# EAGLE design PAYLOAD (EAGLE 9.6.2)
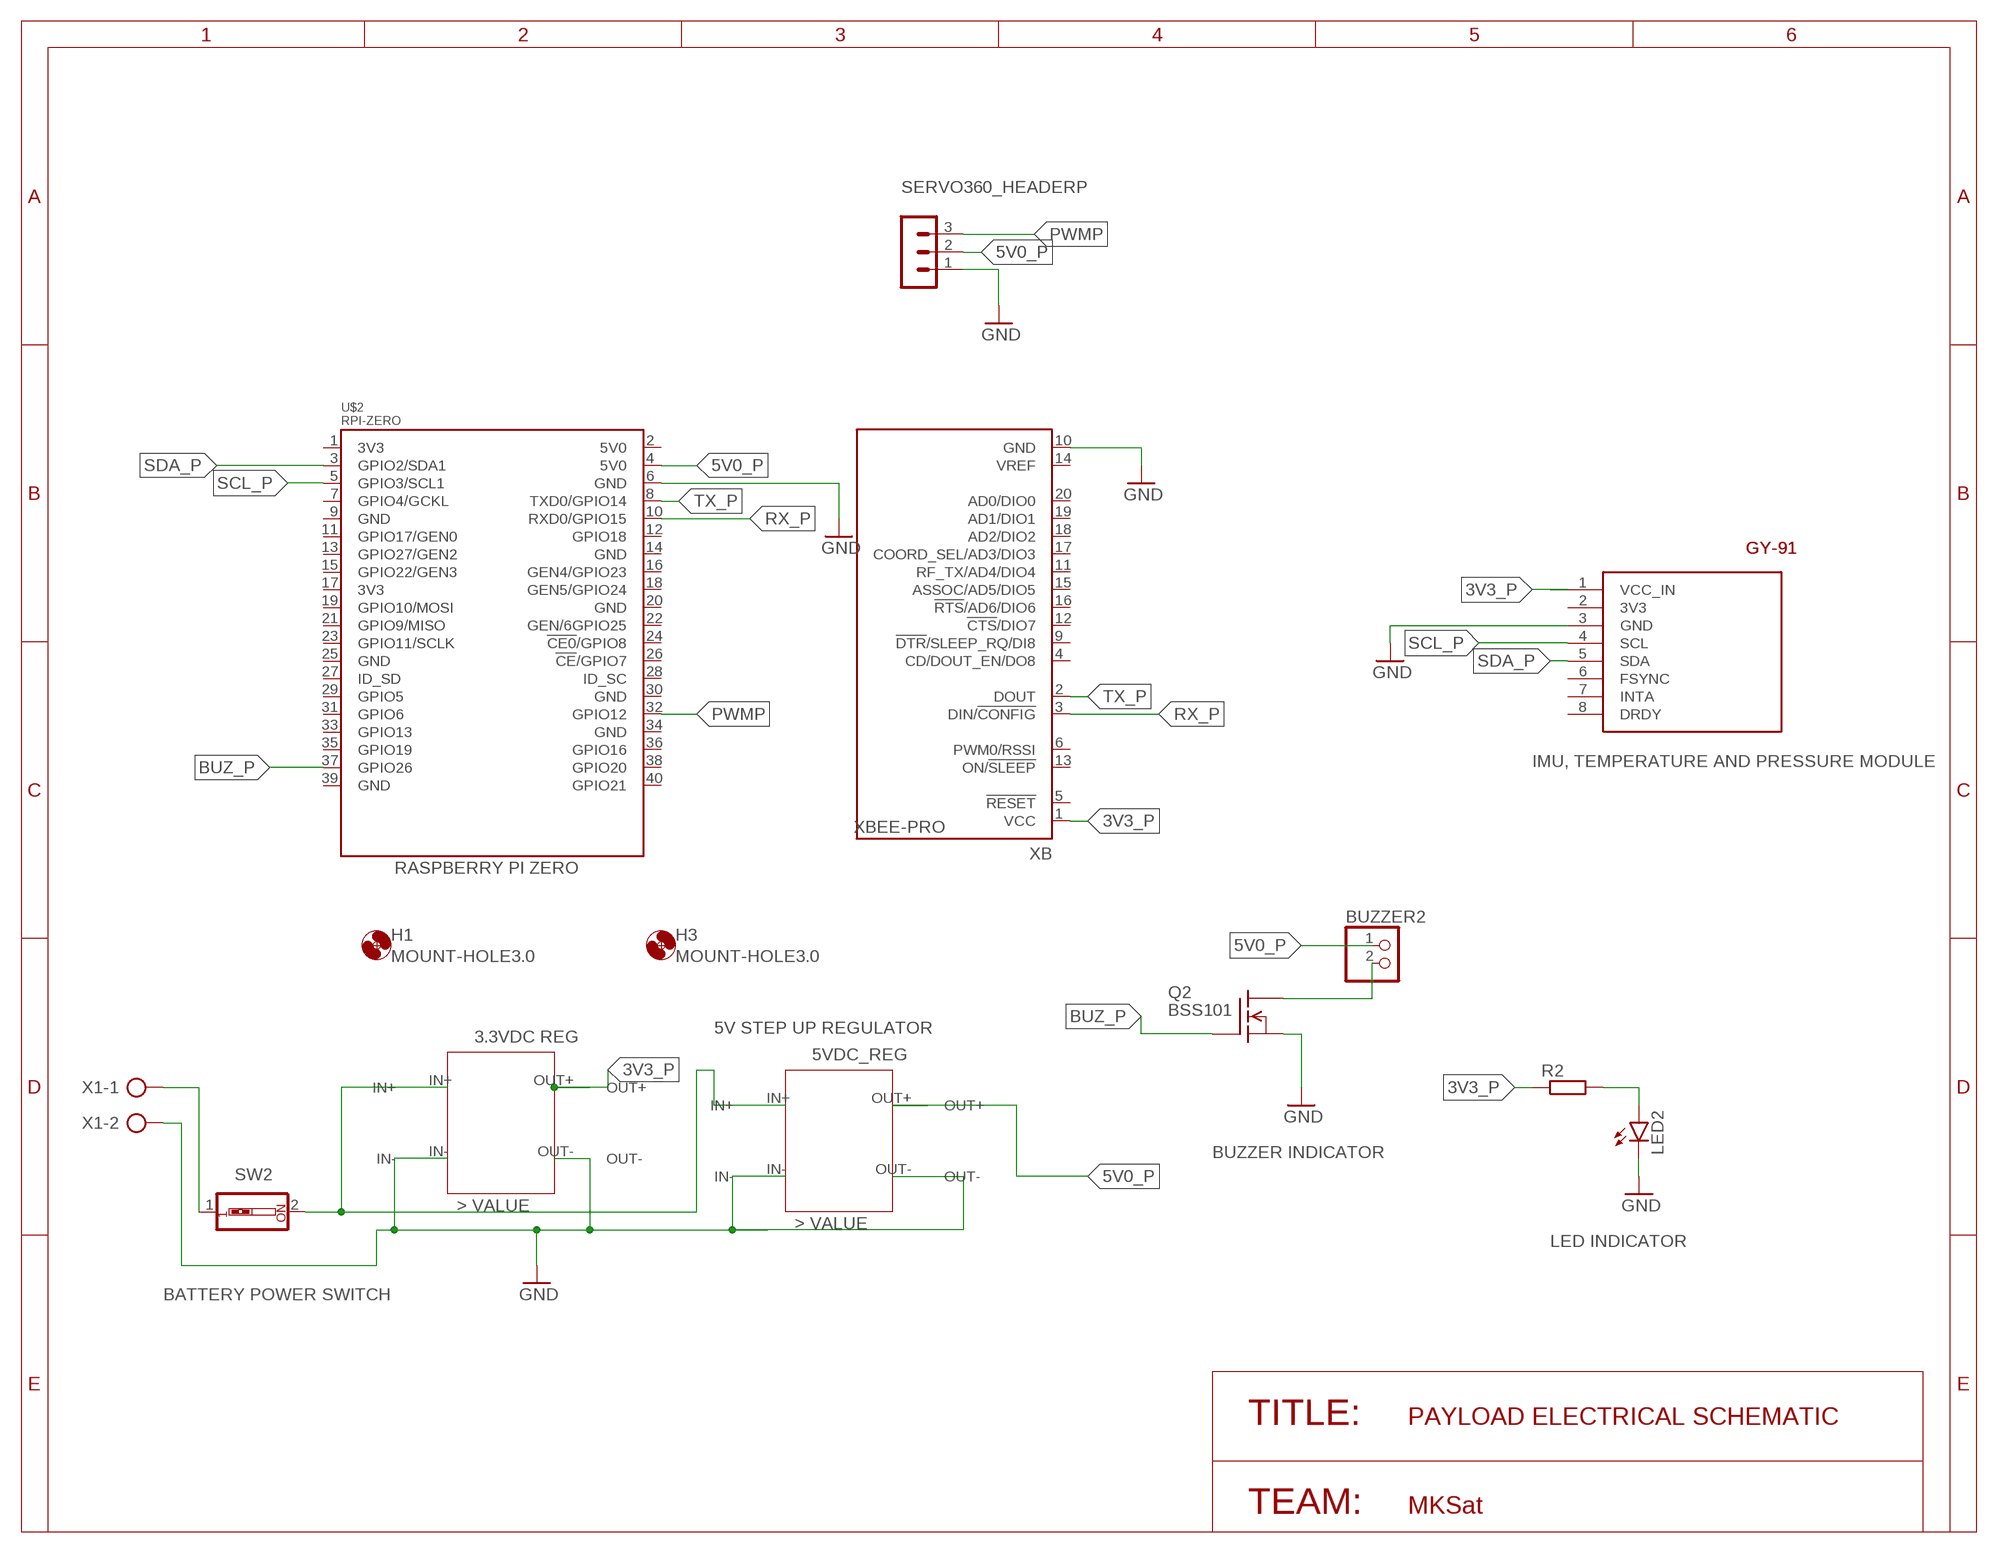
[diagram p0: schematic, sheet 1]

## Parts
BUZZER2  PINHD-1X2/90  [1X02/90]
GY-91  GY-86  [GY-86]
H1  MOUNT-HOLE3.0  [3,0]
H3  MOUNT-HOLE3.0  [3,0]
LED2  LED5MM  [LED5MM]
Q2  BSS101  [TO92]
R2  R-EU_0207/12  [0207/12]
SERVO360_HEADERP  MA03-1  [MA03-1]
SW2  SW_DIP-1  [EDG-01]
U$1  3VDC_REG  [3VDC_REG]
U$2  RPI-ZERO  [RASPBERRYPI_BASTELSTUBE_V13_RASPI_BOARD_B+_FULL]
U$3  5VDC_REG  [5VDC_REG]
X1  AK500/2  [AK500/2]
XB  XBEE-PRO  [XBEE-PRO]

## Nets
3V3_P: GY-91.1(VCC_IN) R2.1 U$1.OUT+ XB.1(VCC)
5V0_P: BUZZER2.1 SERVO360_HEADERP.2 U$2.4(5V0) U$3.OUT+
BUZ_P: Q2.2(G) U$2.37(GPIO26)
GND: GY-91.3(GND) LED2.K(C) Q2.1(S) SERVO360_HEADERP.1 U$1.IN- U$1.OUT- U$2.6(GND) U$3.IN- U$3.OUT- X1.2 XB.10(GND)
N$1: BUZZER2.2 Q2.3(D)
N$2: SW2.2 U$1.IN+ U$3.IN+
N$3: SW2.1 X1.1
N$11: LED2.A R2.2
PWMP: SERVO360_HEADERP.3 U$2.32(GPIO12)
RX_P: U$2.10(RXD0/GPIO15) XB.3(DIN/!CONFIG)
SCL_P: GY-91.4(SCL) U$2.5(GPIO3/SCL1)
SDA_P: GY-91.5(SDA) U$2.3(GPIO2/SDA1)
TX_P: U$2.8(TXD0/GPIO14) XB.2(DOUT)
Unconnected: GY-91.2(3V3) GY-91.6(FSYNC) GY-91.7(INTA) GY-91.8(DRDY) U$2.1(3V3) U$2.2(5V0) U$2.7(GPIO4/GCKL) U$2.9(GND) U$2.11(GPIO17/GEN0) U$2.12(GPIO18) U$2.13(GPIO27/GEN2) U$2.14(GND) U$2.15(GPIO22/GEN3) U$2.16(GEN4/GPIO23) U$2.17(3V3) U$2.18(GEN5/GPIO24) U$2.19(GPIO10/MOSI) U$2.20(GND) U$2.21(GPIO9/MISO) U$2.22(GEN/6GPIO25) U$2.23(GPIO11/SCLK) U$2.24(!CE0!/GPIO8) U$2.25(GND) U$2.26(!CE!/GPIO7) U$2.27(ID_SD) U$2.28(ID_SC) U$2.29(GPIO5) U$2.30(GND) U$2.31(GPIO6) U$2.33(GPIO13) U$2.34(GND) U$2.35(GPIO19) U$2.36(GPIO16) U$2.38(GPIO20) U$2.39(GND) U$2.40(GPIO21) XB.4(CD/DOUT_EN/DO8) XB.5(!RESET) XB.6(PWM0/RSSI) XB.9(!DTR!/SLEEP_RQ/DI8) XB.11(RF_TX/AD4/DIO4) XB.12(!CTS!/DIO7) XB.13(ON/!SLEEP) XB.14(VREF) XB.15(ASSOC/AD5/DIO5) XB.16(!RTS!/AD6/DIO6) XB.17(COORD_SEL/AD3/DIO3) XB.18(AD2/DIO2) XB.19(AD1/DIO1) XB.20(AD0/DIO0)

## Notes on the sheet
- GY-91 | GY-91
- IMU, TEMPERATURE AND PRESSURE MODULE
- RASPBERRY PI ZERO
- 5V STEP UP REGULATOR
- BUZZER INDICATOR
- LED INDICATOR
- BATTERY POWER SWITCH
- TITLE: | PAYLOAD ELECTRICAL SCHEMATIC
- TEAM: | MKSat

## Library data of the parts
BUZZER2 = pinhead:PINHD-1X2: PIN HEADER
GY-91 = GY_Boards:GY-86
H1 H3 = holes:MOUNT-HOLE: MOUNTING HOLE with drill center marker
LED2 = led:LED: LED OSRAM: - CHIPLED LG R971, LG N971, LY N971, LG Q971, LY Q971, LO R971, LY R971 LH N974, LH R974 LS Q976, LO Q976, LY Q976 LO Q996 - Hyper CHIPLED LW Q18S LB Q993, LB Q99A, LB R99A - SideLED LS A670, LO A670, LY A670, LG A670, LP A670 LB A673, LV A673, LT A673, LW A673 LH A674 LY A675 LS A676, LA A676, LO A676, LY A676, LW A676 LS A679, LY A679, LG A679 - Hyper Micro SIDELED® LS Y876, LA Y876, LO Y876, LY Y876 LT Y87S - SmartLED LW L88C, LW L88S LB L89C, LB L89S, LG L890 LS L89K, LO L89K, LY L89K LS L896, LA L896, LO L896, LY L896 - TOPLED LS T670, LO T670, LY T670, LG T670, LP T670 LSG T670, LSP T670, LSY T670, LOP T670, LYG T670 LG T671, LOG T671, LSG T671 LB T673, LV T673, LT T673, LW T673 LH T674 LS T676, LA T676, LO T676, LY T676, LB T676, LH T676, LSB T676, LW T676 LB T67C, LV T67C, LT T67C, LS T67K, LO T67K, LY T67K, LW E67C LS E67B, LA E67B, LO E67B, LY E67B, LB E67C, LV E67C, LT E67C LW T67C LS T679, LY T679, LG T679 LS T770, LO T770, LY T770, LG T770, LP T770 LB T773, LV T773, LT T773, LW T773 LH T774 LS E675, LA E675, LY E675, LS T675 LS T776, LA T776, LO T776, LY T776, LB T776 LHGB T686 LT T68C, LB T68C - Hyper Mini TOPLED® LB M676 - Mini TOPLED Santana® LG M470 LS M47K, LO M47K, LY M47K Source: http://www.osram.convergy.de LUXEON: - LUMILED® LXK2-PW12-R00, LXK2-PW12-S00, LXK2-PW14-U00, LXK2-PW14-V00 LXK2-PM12-R00, LXK2-PM12-S00, LXK2-PM14-U00 LXK2-PE12-Q00, LXK2-PE12-R00, LXK2-PE12-S00, LXK2-PE14-T00, LXK2-PE14-U00 LXK2-PB12-K00, LXK2-PB12-L00, LXK2-PB12-M00, LXK2-PB14-N00, LXK2-PB14-P00, LXK2-PB14-Q00 LXK2-PR12-L00, LXK2-PR12-M00, LXK2-PR14-Q00, LXK2-PR14-R00 LXK2-PD12-Q00, LXK2-PD12-R00, LXK2-PD12-S00 LXK2-PH12-R00, LXK2-PH12-S00 LXK2-PL12-P00, LXK2-PL12-Q00, LXK2-PL12-R00 Source: www.luxeon.com KINGBRIGHT: KA-3528ASYC Source: www.kingbright.com
Q2 = transistor-fet:BSS101: N-Channel Enhancement MOSFET 200V; 0,16A; 11Ohm
R2 = rcl:R-EU_: RESISTOR, European symbol; SPICEPREFIX: R
SERVO360_HEADERP = con-lstb:MA03-1: PIN HEADER; OC_FARNELL: unknown; OC_NEWARK: unknown
SW2 = special:SW_DIP-1: DIP SWITCH
U$1 = VOLTAGE_REGULATORS_CANSAT:3VDC_REG
U$2 = RPI-Zero:RPI-ZERO
U$3 = VOLTAGE_REGULATORS_CANSAT:5VDC_REG
X1 = con-ptr500:AK500/2: CONNECTOR; OC_FARNELL: unknown; OC_NEWARK: unknown
XB = maxstream:XBEE: XBee (TM) /XBee-PRO(TM) OEM RF Modules Source: MaxStream, Inc. xbee_productmanual.pdf; MPN: XBP24-AWI-001; OC_FARNELL: 1337916; OC_NEWARK: 42M2667

## Board
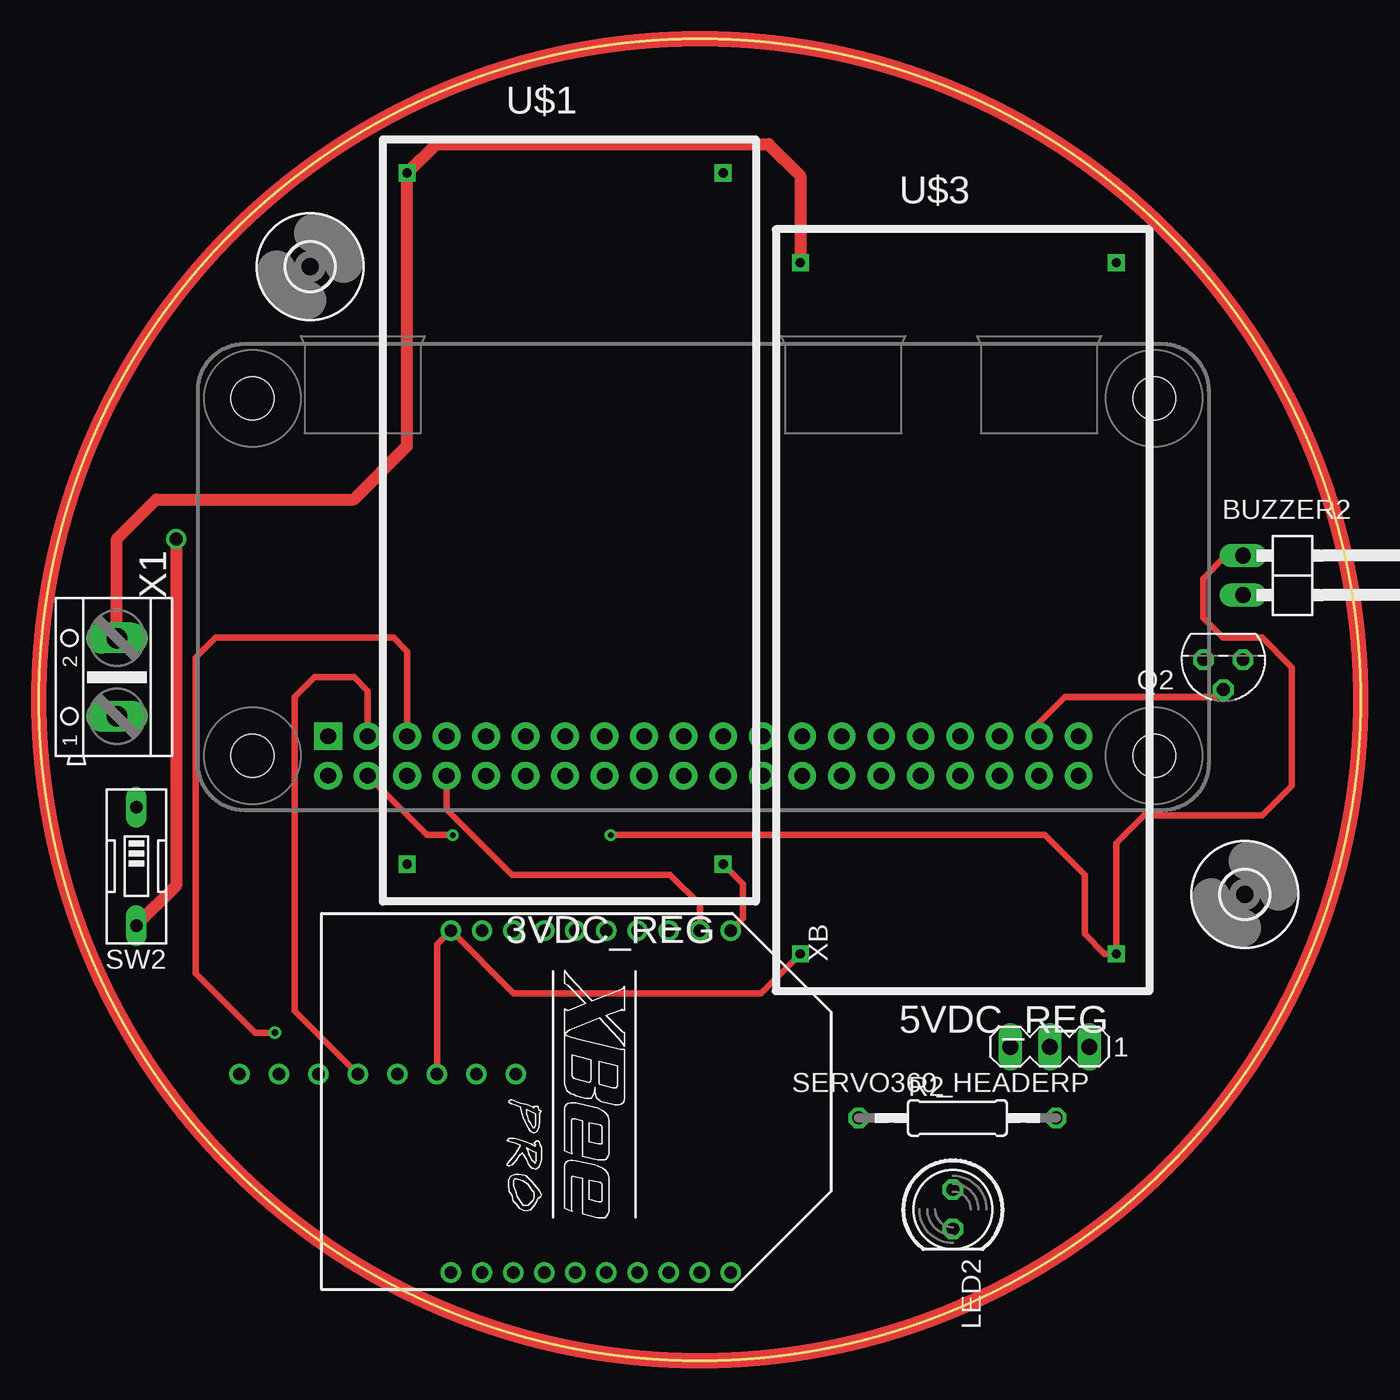
[diagram p1: board, top side]
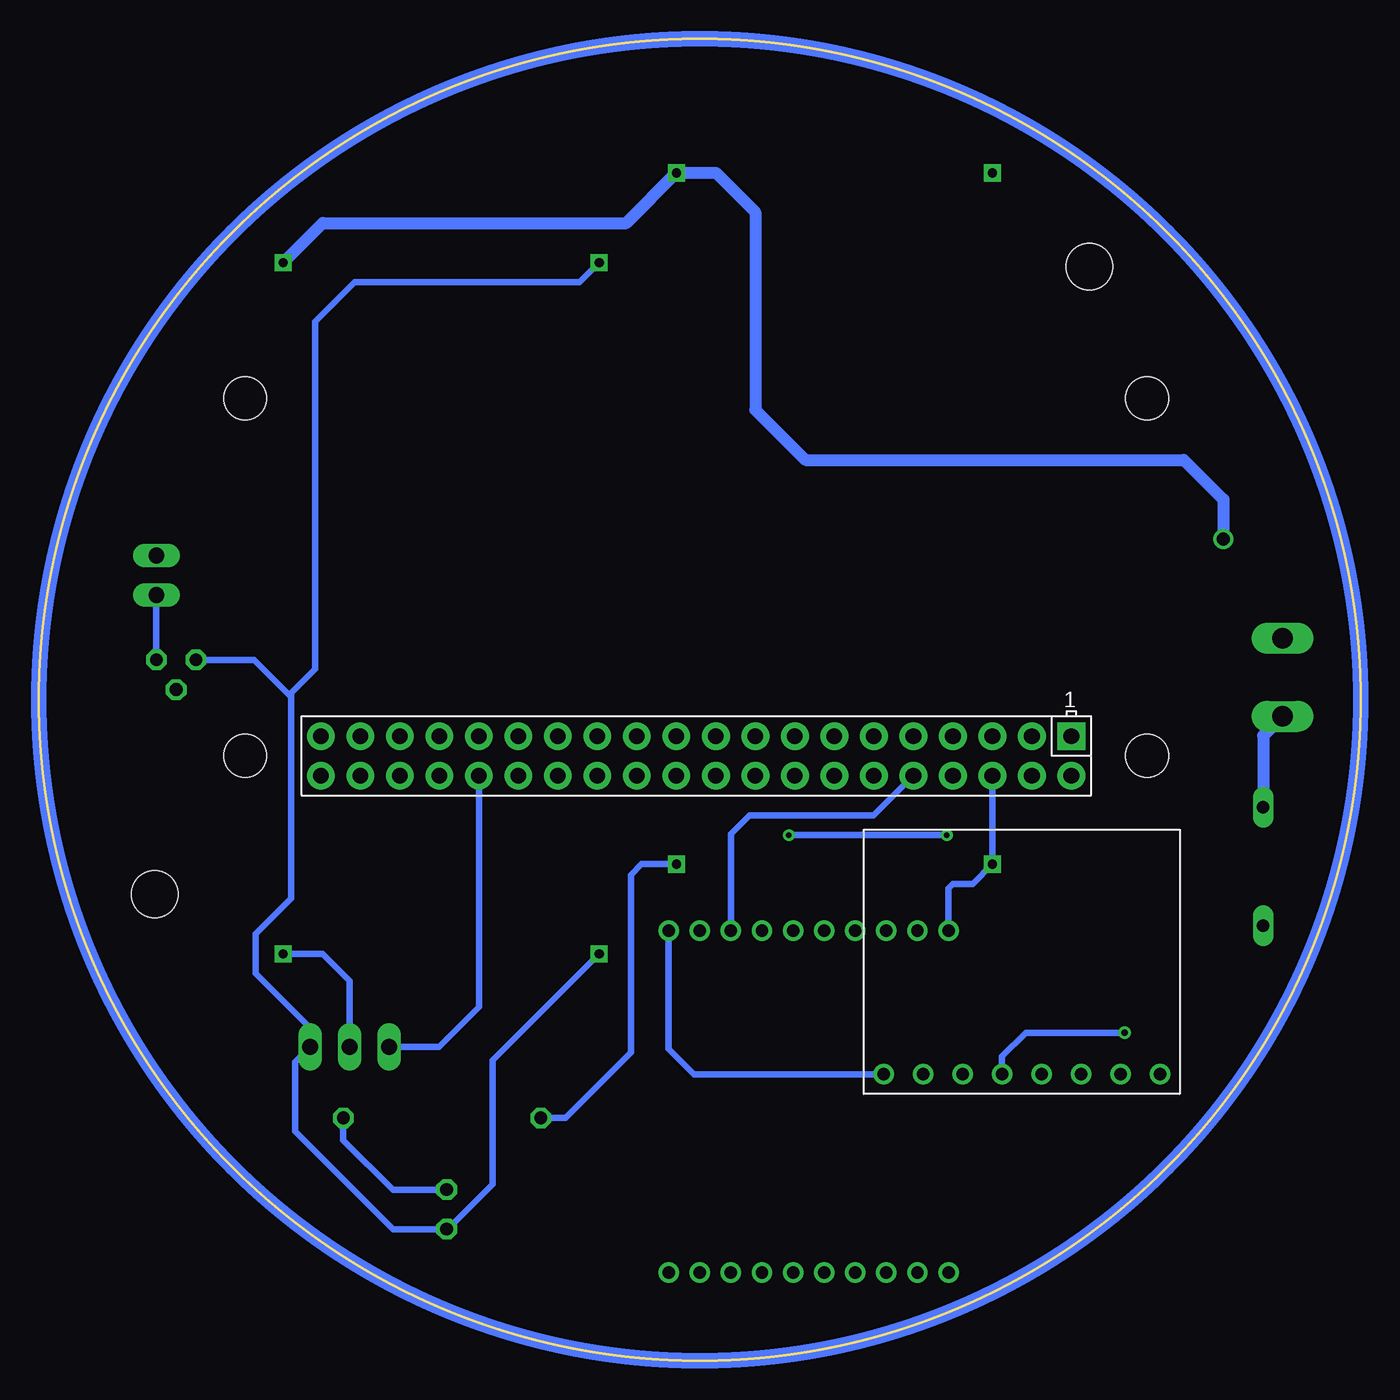
[diagram p2: board, bottom side, seen from below]

Size 85 x 85 mm. Coordinates in mm from the lower left corner, seen from the top.
Outline: circle at 42.5,42.5 radius 42.5
Copper layers (1*16): Top 0.035mm / dielectric 1.5mm / Bottom 0.035mm
Design rules "default *": minimum track width 6mil, minimum drill 0.35mm, track to track 12mil, track to pad 12mil, pad to pad 12mil, via to via 12mil, smd to smd 12mil, copper to edge 40mil, drill to drill 6mil, minimum pad ring 10mil, minimum via ring 8mil, stop-mask expansion 4mil, vias tented up to drill 0mil, thermal gap 10mil

### Footprints (pad centres in the part's own frame; a part is rotated, then mirrored left to right if it is on the bottom)
1X02/90 = drill 1.016 long: 1 -1.27,-3.81; 2 1.27,-3.81
GY-86 = drill 0.8: 1 1.27,19.05; 2 1.27,16.51; 3 1.27,13.97; 4 1.27,11.43; 5 1.27,8.89; 6 1.27,6.35; 7 1.27,3.81; 8 1.27,1.27
3,0 = hole 3: 0,0
LED5MM = drill 0.813 octagon: A -1.27,0; K 1.27,0
TO92 = drill 0.813 octagon: 1 1.27,0; 2 0,1.905; 3 -1.27,0
0207/12 = drill 0.813 octagon: 1 -6.35,0; 2 6.35,0
MA03-1 = drill 1.016 long: 1 -2.54,0; 2 0,0; 3 2.54,0
EDG-01 = drill 0.813 long: 1 0,-3.81; 2 0,3.81
3VDC_REG = drill 0.6 square: IN+ -22.86,8.89; IN- -22.86,-11.43; OUT+ 21.59,8.89; OUT- 21.59,-11.43
RASPBERRYPI_BASTELSTUBE_V13_RASPI_BOARD_B+_FULL = drill 1 pad 1.778 square: 1 8.37,25.23 | drill 1 pad 1.778: 2 8.37,27.77; 3 10.91,25.23; 4 10.91,27.77; 5 13.45,25.23; 6 13.45,27.77; 7 15.99,25.23; 8 15.99,27.77; 9 18.53,25.23; 10 18.53,27.77; 11 21.07,25.23; 12 21.07,27.77; 13 23.61,25.23; 14 23.61,27.77; 15 26.15,25.23; 16 26.15,27.77; 17 28.69,25.23; 18 28.69,27.77; 19 31.23,25.23; 20 31.23,27.77; 21 33.77,25.23; 22 33.77,27.77; 23 36.31,25.23; 24 36.31,27.77; 25 38.85,25.23; 26 38.85,27.77; 27 41.39,25.23; 28 41.39,27.77; 29 43.93,25.23; 30 43.93,27.77; 31 46.47,25.23; 32 46.47,27.77; 33 49.01,25.23; 34 49.01,27.77; 35 51.55,25.23; 36 51.55,27.77; 37 54.09,25.23; 38 54.09,27.77; 39 56.63,25.23; 40 56.63,27.77 | hole 2.75: 3.5,3.5; 3.5,26.5; 61.5,3.5; 61.5,26.5
5VDC_REG = drill 0.6 square: IN+ -22.86,8.89; IN- -22.86,-11.43; OUT+ 21.59,8.89; OUT- 21.59,-11.43
AK500/2 = drill 1.321 long: 1 -2.515,0; 2 2.515,0
XBEE-PRO = drill 0.8 pad 1.27: 1 -11,9; 2 -11,7; 3 -11,5; 4 -11,3; 5 -11,1; 6 -11,-1; 7 -11,-3; 8 -11,-5; 9 -11,-7; 10 -11,-9; 11 11,-9; 12 11,-7; 13 11,-5; 14 11,-3; 15 11,-1; 16 11,1; 17 11,3; 18 11,5; 19 11,7; 20 11,9

### Placement (x,y rotation side)
BUZZER2  81.25,50.5 270 top
GY-91  11.63,17.15 90 bottom
H1  17.44,70.36 0 top
H3  77.56,29.99 0 top
LED2  58.78,9.72 270 top
Q2  76.17,45.06 180 top
R2  59.07,15.61 0 top
SERVO360_HEADERP  65.01,20.18 180 top
SW2  6.27,31.79 180 top
U$1  35.11,53.52 270 top
U$2  10.23,65.39 180 bottom
U$3  60.4,47.75 270 top
X1  5.02,43.95 90 top
XB  35.5,16.66 270 top

### Tracks (layer width: path | path; a pad name or v marks a point on that pad's centre or on a via)
3V3_P
  Top 0.406: XB.1 45.27,28.43 45.27,30.66 U$1.OUT+
  Bottom 0.406: U$1.OUT+ 46.25,31.93 46.93,31.25 46.93,19.82 51.14,15.61 R2.1 | XB.1 44.5,20.04 42.88,18.42 GY-91.1
5V0_P  (via drill 0.35)
  Top 0.406: v36.77,33.79 64.71,33.79 67.25,31.25 67.25,27.44 68.53,26.16 U$3.OUT+ 69.29,33.29 71.06,35.06 78.68,35.06 80.59,36.97 80.59,44.59 78.68,46.49 76.14,46.49 74.87,47.76 74.87,50.3 76.34,51.77 BUZZER2.1 | U$2.4 24.97,33.79 v26.61,33.79
  Bottom 0.406: v26.61,33.79 v36.77,33.79 | U$3.OUT+ 66.75,26.16 65.01,24.42 SERVO360_HEADERP.2
BUZ_P
  Top 0.406: U$2.37 64.32,41.02 65.98,42.68 75.69,42.68 Q2.2
GND
  Top 0.406: GY-91.3 25.6,26.76 XB.10 30.54,23.62 46.43,23.62 U$3.OUT-
  Top 0.762: X1.2 5.02,52.84 7.56,55.38 20.26,55.38 23.68,58.8 U$1.IN- 25.54,78.24 46.93,78.24 48.97,76.2 U$3.IN-
  Bottom 0.254: 58.78,8.39 LED2.K
  Bottom 0.406: U$3.IN- 50.23,69.35 64.71,69.35 67.25,66.81 67.25,44.49 68.79,42.95 68.79,42.68 | U$3.OUT- 55.82,19.31 55.82,11.35 58.78,8.39 | XB.10 26.5,30.38 26.22,30.66 24.95,30.66 U$1.OUT- U$2.6 | 68.79,42.68 68.79,29.71 71.06,27.44 71.06,24.9 67.55,21.39 SERVO360_HEADERP.1 68.52,19.21 68.52,14.74 62.23,8.45 LED2.K | Q2.1 71.17,45.06 68.79,42.68
N$1
  Bottom 0.406: BUZZER2.2 Q2.3
N$2  (via drill 0.85)
  Top 0.762: v8.83,52.84 8.83,30.54 SW2.2
  Bottom 0.762: U$3.IN+ 66.74,73.16 47.22,73.16 U$1.IN+ 41.46,76.38 38.92,73.84 38.92,61.14 35.7,57.92 11.37,57.92 8.83,55.38 v8.83,52.84
N$3
  Bottom 0.762: X1.1 6.27,40.19 SW2.1
N$11
  Bottom 0.406: LED2.A 62.23,10.99 65.42,14.18 R2.2
PWMP
  Bottom 0.406: U$2.32 56.7,22.75 59.27,20.18 SERVO360_HEADERP.3
RX_P
  Bottom 0.406: U$2.10 31.32,35.06 39.31,35.06 40.5,33.87 XB.3
SCL_P  (via drill 0.4)
  Top 0.406: v15.18,21.09 13.91,21.09 10.1,24.9 10.1,45.22 11.37,46.49 22.8,46.49 23.68,45.61 U$2.5
  Bottom 0.406: v15.18,21.09 21.53,21.09 23.06,19.56 GY-91.4
SDA_P
  Top 0.406: U$2.3 21.14,43.07 20.26,43.95 17.72,43.95 16.45,42.68 16.45,22.49 GY-91.5
TX_P
  Top 0.406: U$2.8 26.22,35.45 30.42,31.25 40.58,31.25 42.5,29.33 XB.2
(copper drawn outside any net)
  shapes: Bottom circle x1, Top circle x1